# Altium schematic sheet DCDC.SchDoc
size A3; SheetNumber: 6; SheetTotal: 9
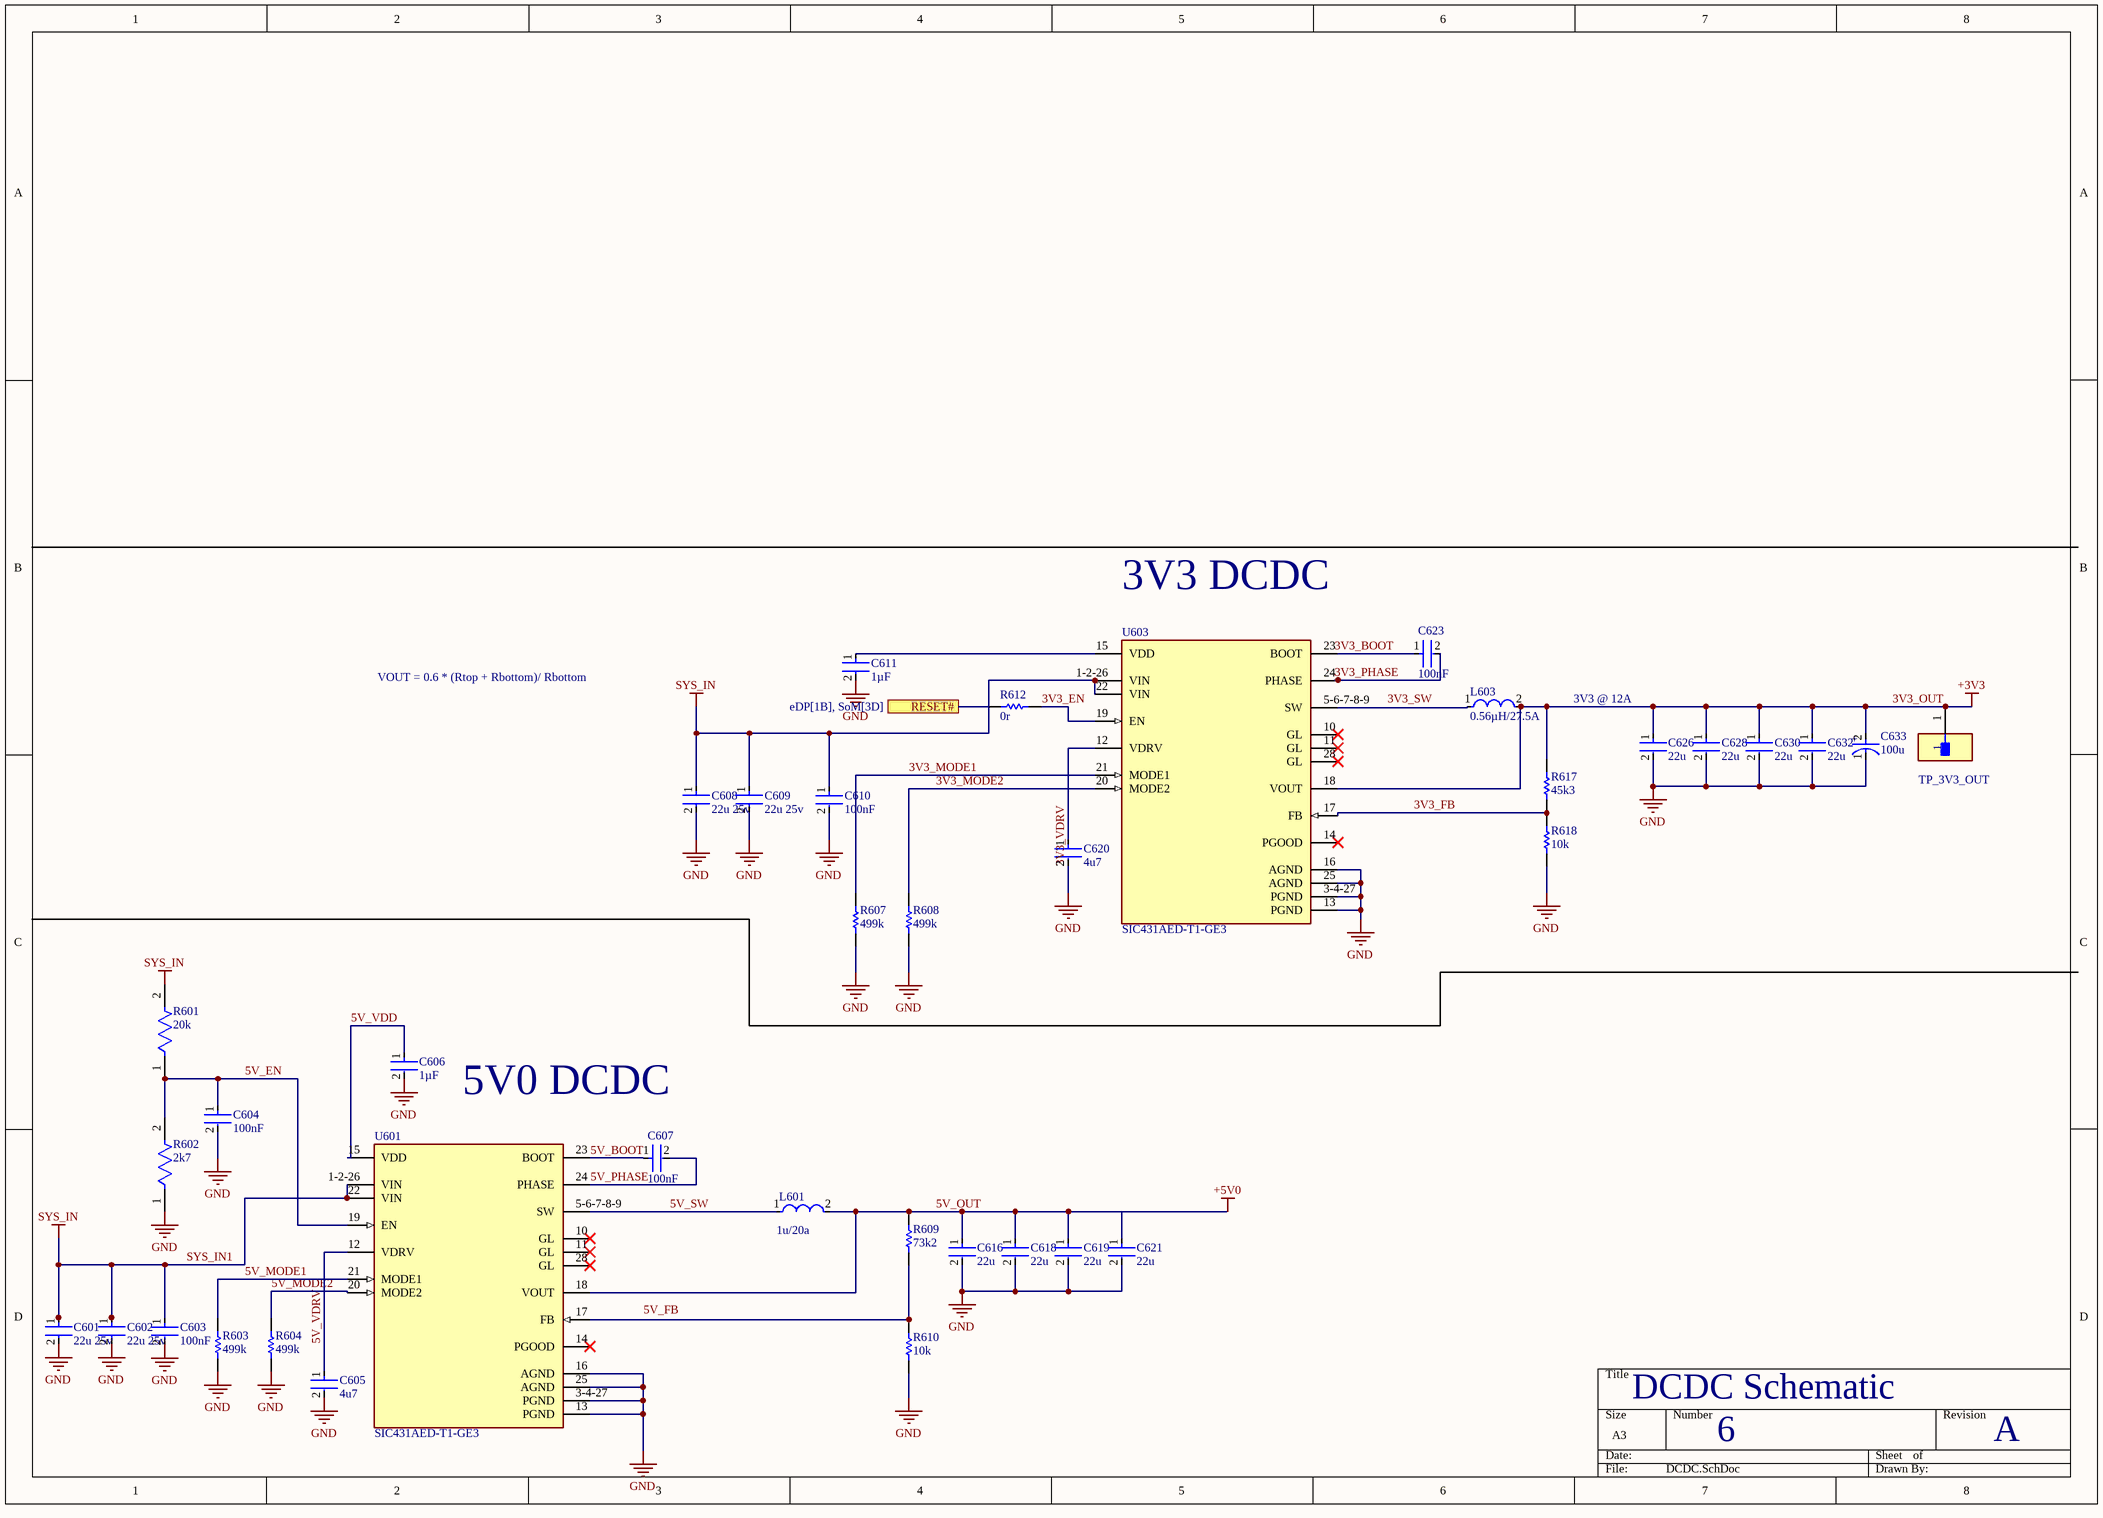
[diagram p0: DCDC.SchDoc]

## Parts
C601  22u 25v  [FP-GRM21B-0_2-e0_2_0_7-IPC_B]
C602  22u 25v  [FP-GRM21B-0_2-e0_2_0_7-IPC_B]
C603  100nF  [FP-GRM155-0_05-IPC_B]
C604  100nF  [FP-GRM155-0_05-IPC_B]
C605  4u7  [FP-GRM155-0_2-MFG]
C606  1µF  [FP-GRM15-0_1-MFG]
C607  100nF  [FP-GRM155-0_05-IPC_B]
C608  22u 25v  [FP-GRM21B-0_2-e0_2_0_7-IPC_B]
C609  22u 25v  [FP-GRM21B-0_2-e0_2_0_7-IPC_B]
C610  100nF  [FP-GRM155-0_05-IPC_B]
C611  1µF  [FP-GRM15-0_1-MFG]
C616  22u  [FP-CL10-IPC_B]
C618  22u  [FP-CL10-IPC_B]
C619  22u  [FP-CL10-IPC_B]
C620  4u7  [FP-GRM155-0_2-MFG]
C621  22u  [FP-CL10-IPC_B]
C623  100nF  [FP-GRM155-0_05-IPC_B]
C626  22u  [FP-CL10-IPC_B]
C628  22u  [FP-CL10-IPC_B]
C630  22u  [FP-CL10-IPC_B]
C632  22u  [FP-CL10-IPC_B]
C633  100u  [FP-OS-CON-SMT-B6-MFG]
L601  1u/20a  [FP-SRP6050CA-MFG]
L603  0.56µH/27.5A  [FP-IHLP-4040DZ-FP_3_175x4-MFG]
R601  20k  [FP-CR0402-IPC_A]
R602  2k7  [FP-CR0402-IPC_B]
R603  499k  [RESC1005X40X25NL10T10]
R604  499k  [RESC1005X40X25NL10T10]
R607  499k  [RESC1005X40X25NL10T10]
R608  499k  [RESC1005X40X25NL10T10]
R609  73k2  [RESC1005X40X25LL10T10]
R610  10k  [RESC1005X40X25LL05T10]
R612  0r  [RESC1005X40X25LL05T05]
R617  45k3  [RESC1005X40X25ML05T10]
R618  10k  [RESC1005X40X25LL05T10]
TP603  TP_3V3_OUT  [FP-S2751-46R-MFG]
U601  SIC431AED-T1-GE3  [FP-T22-0442-MFG]
U603  SIC431AED-T1-GE3  [FP-T22-0442-MFG]

## Ports
RESET# (see eDP[1B], SoM[3D])

## Nets
3V3_OUT: C626.1 C628.1 C630.1 C632.1 C633.2(A) L603.2 R617.2 TP603.1 U603.18(VOUT)  [also labelled +3V3]
3V3_VDRV: C601.2 C602.2 C603.2 C604.2 C605.2 C606.2 C608.2 C609.2 C610.2 C611.2 C616.2 C618.2 C619.2 C620.2 C621.2 C626.2 C628.2 C630.2 C632.2 C633.1(C) R602.1 R603.1 R604.1 R607.1 R608.1 R610.1 R618.1 U601.3-4-27(PGND) U601.13(PGND) U601.16(AGND) U601.25(AGND) U603.3-4-27(PGND) U603.13(PGND) U603.16(AGND) U603.25(AGND)  [also labelled GND]
SYS_IN1: C601.1 C602.1 C603.1 C608.1 C609.1 C610.1 R601.2 U601.1-2-26(VIN) U601.22(VIN) U603.1-2-26(VIN) U603.22(VIN)  [also labelled SYS_IN]
3V3_EN: R612.2 U603.19(EN)
3V3_FB: R617.1 R618.2 U603.17(FB)
3V3_MODE1: R607.2 U603.21(MODE1)
3V3_MODE2: R608.2 U603.20(MODE2)
3V3_PHASE: C623.2 U603.24(PHASE)
5V_EN: C604.1 R601.1 R602.2 U601.19(EN)
5V_MODE1: R603.2 U601.21(MODE1)
5V_MODE2: R604.2 U601.20(MODE2)
5V_OUT: C616.1 C618.1 C619.1 C621.1 L601.2 R609.2 U601.18(VOUT)
5V_PHASE: C607.2 U601.24(PHASE)
5V_SW: L601.1 U601.5-6-7-8-9(SW)
5V_VDD: C606.1 U601.15(VDD)
5V_VDRV: C605.1 U601.12(VDRV)
RESET#: R612.1 ; port RESET#
NetC607_1: C607.1 U601.23(BOOT)
NetC611_1: C611.1 U603.15(VDD)
NetC620_1: C620.1 U603.12(VDRV)
NetC623_1: C623.1 U603.23(BOOT)
NetL603_1: L603.1 U603.5-6-7-8-9(SW)
NetR609_1: R609.1 R610.2 U601.17(FB)

Not connected (* = marked no-connect by the designer): U601 10(GL)* 11(GL)* 14(PGOOD)* 28(GL)*; U603 10(GL)* 11(GL)* 14(PGOOD)* 28(GL)*

## Notes on the sheet
- (near U603) 3V3 DCDC
- VOUT = 0.6 * (Rtop + Rbottom)/ Rbottom
- 3V3 @ 12A
- 5V0 DCDC
- DCDC Schematic
- 6
- A
- Labels drawn without touching a wire or pin: 3V3_BOOT, 3V3_SW, 5V_BOOT, 5V_FB, +5V0
- (in symbol CMP-05428-000099-1) +

## Library data of the parts
C601 C602 C608 C609 = CMP-2007-03222-3: Chip Multilayer Ceramic Capacitors for General Purpose, 0805, 22uF, X5R, 15%, 20%, 25V; Case/Package: 0805; Depth: 1.25mm; Resistor Type: Ceramic; Voltage Rating: 25V; Lead Free: Lead Free; Voltage Rating (DC): 25V; Case Code (Metric): 2012; Thickness: 0.057inch; REACH SVHC: No SVHC; Material: Ceramic; Tolerance: 20%; Length: 2mm; Capacitance: 22uF; Case Code (Imperial): 0805; Max Operating Temperature: 85°C; Termination: SMD/SMT; Weight: 0.000335oz; Dielectric: X5R; Packaging: Tape and Reel; Voltage: 25V; Package Quantity: 3000; Height: 1.25mm; Mount: Surface Mount; Width: 1.25mm; Min Operating Temperature: -55°C
C603 C604 C607 C610 C623 = CMP-2008-04639-2: Chip Multilayer Ceramic Capacitors for General Purpose, 0402, 0.10uF, X7R, 15%, 10%, 50V; Dissipation Factor: 0.025%; Weight: 0.000212oz; Thickness: 0.022inch; Voltage Rating (DC): 50V; Dielectric Material: Ceramic; Termination: SMD/SMT; Case/Package: 0402; Case Code (Imperial): 0402; Mount: Surface Mount; REACH SVHC: No SVHC; Resistor Type: Ceramic; Dielectric: X7R; Max Operating Temperature: 125°C; Voltage: 50V; Lead Free: Lead Free; Package Quantity: 10000; Packaging: Tape and Reel; Capacitance: 100nF; Length: 1mm; Material: Ceramic; Height: 0.5mm; Depth: 0.5mm; Width: 0.5mm; Min Operating Temperature: -55°C; Tolerance: 10%; Case Code (Metric): 1005; Voltage Rating: 50V
C605 C620 = CMP-06035-063317-1: Chip Multilayer Ceramic Capacitors for General Purpose 0402 Package 0.7mm 4.7uF @ 20% 25Vdc X5S @ 22%
C606 C611 = CMP-2008-04556-2: CAP CER 1UF 10V X5R 0402; Manufacturer Part Number: GRM155R61A105KE15D; Manufacturer: Murata; Material: Ceramic; Tolerance: 10%; Temperature Coefficient: 15%; Octopart: https://octopart.com/grm155r61a105ke15d-murata-197442; Lead Free: Yes; ComponentLink2Description: Datasheet; Temperature: -55°C to +85°C; Temperature Range High: +85°C; Height: 0.55mm; Capacitance: 1uF; Ipc Land Pattern Name: CAPC10050X50; ComponentLink2URL: https://search.murata.co.jp/Ceramy/image/img/A01X/G101/ENG/GRM155R61A105KE15-01A.pdf; Temperature Range Low: -55°C; Device Class L2: Capacitors; Voltage Rating: 10V; RoHS: TRUE; Device Class L1: Passive Components; Device Class L3: Ceramic Capacitors; Temperature Characteristic: X5R; Mouser Description: 0402 1 uF 10 V ±10% Tolerance X5R Surface Mount Multilayer Ceramic Capacitor; Automotive: No; Package: GRM15-0.1; Digikey Description: CAP CER 1UF 10V X5R 0402; Value: 1uF; Category: Cap
C616 C618 C619 C621 C626 C628 C630 C632 = CMP-13271-002755-1: Cap Ceramic 22uF 16V X5R ±20% Pad SMD 0603 +85°C T/R; Mount: Surface Mount; Packaging: Tape and Reel; Case Code (Imperial): 0603; Max Operating Temperature: 85°C; Capacitance: 22uF; Case/Package: 0603; Voltage Rating: 16V; Tolerance: 20%; Case Code (Metric): 1608; Min Operating Temperature: -55°C
C633 = CMP-05428-000099-1: Conductive Polymer Aluminum Solid Capacitors (OS-CON) 100uF ±20% 6.3V; Ripple Current (AC): 1.97A; Dissipation Factor: 12%; Leakage Current: 300uA; ESR (Equivalent Series Resistance): 30mR; Life (Hours): 2000Hour; Polarity: Polar; Package Quantity: 1500; RoHS Compliant: Yes; Number of Pins: 6; Termination: SMD/SMT; Tolerance: 20%; Mount: Surface Mount; Case/Package: Radial; Ripple Current: 1.97A; Min Operating Temperature: -55°C; REACH SVHC: No SVHC; Height - Seated (Max): 0.236inch; Height: 5.9mm; Lead Free: Lead Free; Voltage: 6.3V; Capacitance: 100uF; Diameter: 5mm; Voltage Rating (DC): 6.3V; Construction: Cylindrical; Length: 5.9mm; Max Operating Temperature: 105°C; Packaging: Tape and Reel; Voltage Rating: 6.3V; Series: OS-CON™, SVPC
L601 = CMP-07248-000017-1: FIXED IND 1UH 20A 4.52 MOHM SMD; Manufacturer: Bourns; Manufacturer Part Number: SRP6050CA-1R0M; Shielding: true; Saturation Current: 23A; Core Material: Metal alloy powder; Series Resistance: 4.52mΩ; Tolerance: 20%; Self Resonant Frequency: 50MHz; Automotive Grade: Grade 0; Test Frequency: 100kHz; Octopart: https://octopart.com/srp6050ca-1r0m-bourns-92222725; Device Class L1: Passive Components; RoHS: TRUE; Device Class L2: Inductors; Temperature Range High: +155°C; Value: 1uH; Inductance: 1uH; Automotive: Yes; Height: 5mm; Package: SRP6050CA; Category: Ind; ComponentLink2Description: Datasheet; Device Class L3: Fixed Inductors; Mouser Description: Inductor Power Shielded Wirewound 1uH 20% 100KHz Metal Alloy Powder 20A 4.52mOhm DCR T/R; ComponentLink2URL: https://www.bourns.com/docs/Product-Datasheets/SRP6050CA.pdf; Lead Free: Yes; Temperature Range Low: -55°C; Rms Current: 20A; Temperature: -55°C to +155°C; Digikey Description: FIXED IND 1UH 20A 4.52 MOHM SMD; Composition: Wirewound
L603 = CMP-02424-000366-1: Commercial Inductors, High Saturation Series 0.56uH 27.5A 1.8mΩ 20%; Shielding: Shielded; Max DC Current: 49A; Inductance: 560nH; Core Material: Metal; DC Resistance (DCR): 1.8mR; Test Frequency: 100kHz; Self Resonant Frequency: 5MHz; Termination: SMD/SMT; RMS Current (Irms): 27.5A; Height: 4mm; Lead Free: Lead Free; Saturation Current: 49A; Tolerance: 20%; Contact Plating: Tin; Max Operating Temperature: 125°C; Case Code (Imperial): 4040; Radiation Hardening: No; Width: 10.3mm; Depth: 10.3mm; Length: 10.92mm; Min Operating Temperature: -55°C; Current Rating: 27.5A; Package Quantity: 500; Number of Pins: 2; Packaging: Tape and Reel; Military Standard: Not; Inductance Tolerance: 20%; Weight: 0.070548oz; Mount: Surface Mount; Case/Package: 4040
R601 = CMP-1011-00655-3: Thick Film Chip Resistors 0402 20kΩ 0.0625W 1% 100ppm/°C; Power Rating: 62.5mW; Voltage Rating: 50V; Resistance: 20kR; Tolerance: 1%; Case Code (Metric): 1005; Termination: SMD/SMT; Composition: Thick Film; Packaging: Tape and Reel; Radiation Hardening: No; Package Quantity: 10000; Mount: Surface Mount; Depth: 0.5mm; Max Operating Temperature: 125°C; Length: 1mm; Width: 0.5mm; Temperature Coefficient: 100ppm/°C; Min Operating Temperature: -55°C; Thickness: 356um; Case/Package: 0402; Military Standard: Not; Case Code (Imperial): 0402; Height: 0.35mm; Contact Plating: Tin
R602 = CMP-2002-05009-2: Thick Film Chip Resistors 0402 2.7kΩ 0.0625W 1% 100ppm/°C; Max Power Dissipation: 63mW; Resistance: 2.7kR; Power Rating: 62.5mW; Voltage Rating: 50V; Tolerance: 1%; Max Operating Temperature: 125°C; Mount: Surface Mount; Case Code (Imperial): 0402; Package Quantity: 10000; Composition: Thick Film; Depth: 0.5mm; Thickness: 356um; Case/Package: 0402; Min Operating Temperature: -55°C; Case Code (Metric): 1005; Contact Plating: Tin; Width: 0.02inch; Packaging: Tape and Reel; Height: 0.016inch; Number of Terminations: 2; Length: 1mm; Temperature Coefficient: 100ppm/°C; Termination: SMD/SMT; Radiation Hardening: No; Military Standard: Not
R603 R604 R607 R608 = CMP-1011-00815-2: Manufacturer: Bourns; Part Number: CR0402-FX-4993GLF
R609 = CMP-2002-05384-1: Manufacturer: Bourns; Part Number: CR0402-FX-7322GLF
R610 R618 = CMP-2002-07353-1: Part Number: RC0402FR-0710KL; Manufacturer: Yageo / Phycomp
R612 = CMP-2000-07451-1: Chip Resistor, 0 Ohm, 0.1 W, -55 to 155 degC, 0402 (1005 Metric), RoHS, Tape and Reel; Manufacturer: Panasonic; Voltage Rating (DC): 50V; Temperature Coefficient: 600ppm/��C; Max Power Dissipation: 100mW; Resistance: 0mOhm; Tolerance: 5%; Number of Terminations: 2; Mount: SurfaceMount; Height: 0.35mm; Packaging: TapeandReel; Contact Plating: Tin; Manufacturer URL: http://www.panasonic.com/; Composition: ThickFilm; Max Operating Temperature: 155degC; REACH SVHC: NoSVHC; Case/Package: 0402; Package Reference: 402; Depth: 0.5mm; Package Description: 2-Pin Surface Mount Device, Body 1 x 0.5 mm; Datasheet URL: https://industrial.panasonic.com/cdbs/www-data/pdf/RDA0000/AOA0000C301.pdf; RoHSCompliant: True; Case Code (Imperial): 0402; Military Standard: Not; Min Operating Temperature: -55degC; Power Rating: 100mW; Datasheet Version: 03/2015; Length: 1mm; Case Code (Metric): 1005; Termination: SMD/SMT; Mounting Technology: SurfaceMount; Voltage Rating: 50V; Width: 0.02inch; Package Quantity: 1; Lead Free: LeadFree; Radiation Hardening: No
R617 = CMP-2002-07692-1: Part Number: RC0402FR-0745K3L; Manufacturer: Yageo / Phycomp
TP603 = CMP-15817-000010-1: PC TEST POINT NATURAL; Plating: Tin; Body Material: Brass; Color: Natural; Material: Copper Alloy; Mount: Surface Mount; Packaging: Cut Tape
U601 U603 = CMP-00030-87948104-1: SIC431AED-T1-GE3 IC Reg Buck Adj 24A MLP44-24; Max Supply Voltage: 24V; Number of Outputs: 1; Max Junction Temperature (Tj): 125°C; Min Supply Voltage: 3V; Output Voltage: 20V; NexarPartId: 87948104; Min Operating Temperature: -40°C; Schedule B: 8542390000, 8542390000; RoHS: Non-Compliant; Max Operating Temperature: 125°C; Height: 800µm; Ambient Temperature Range High: 105°C; Output Current: 24A